# Altium project Benchtest_PIC32.PrjPcb
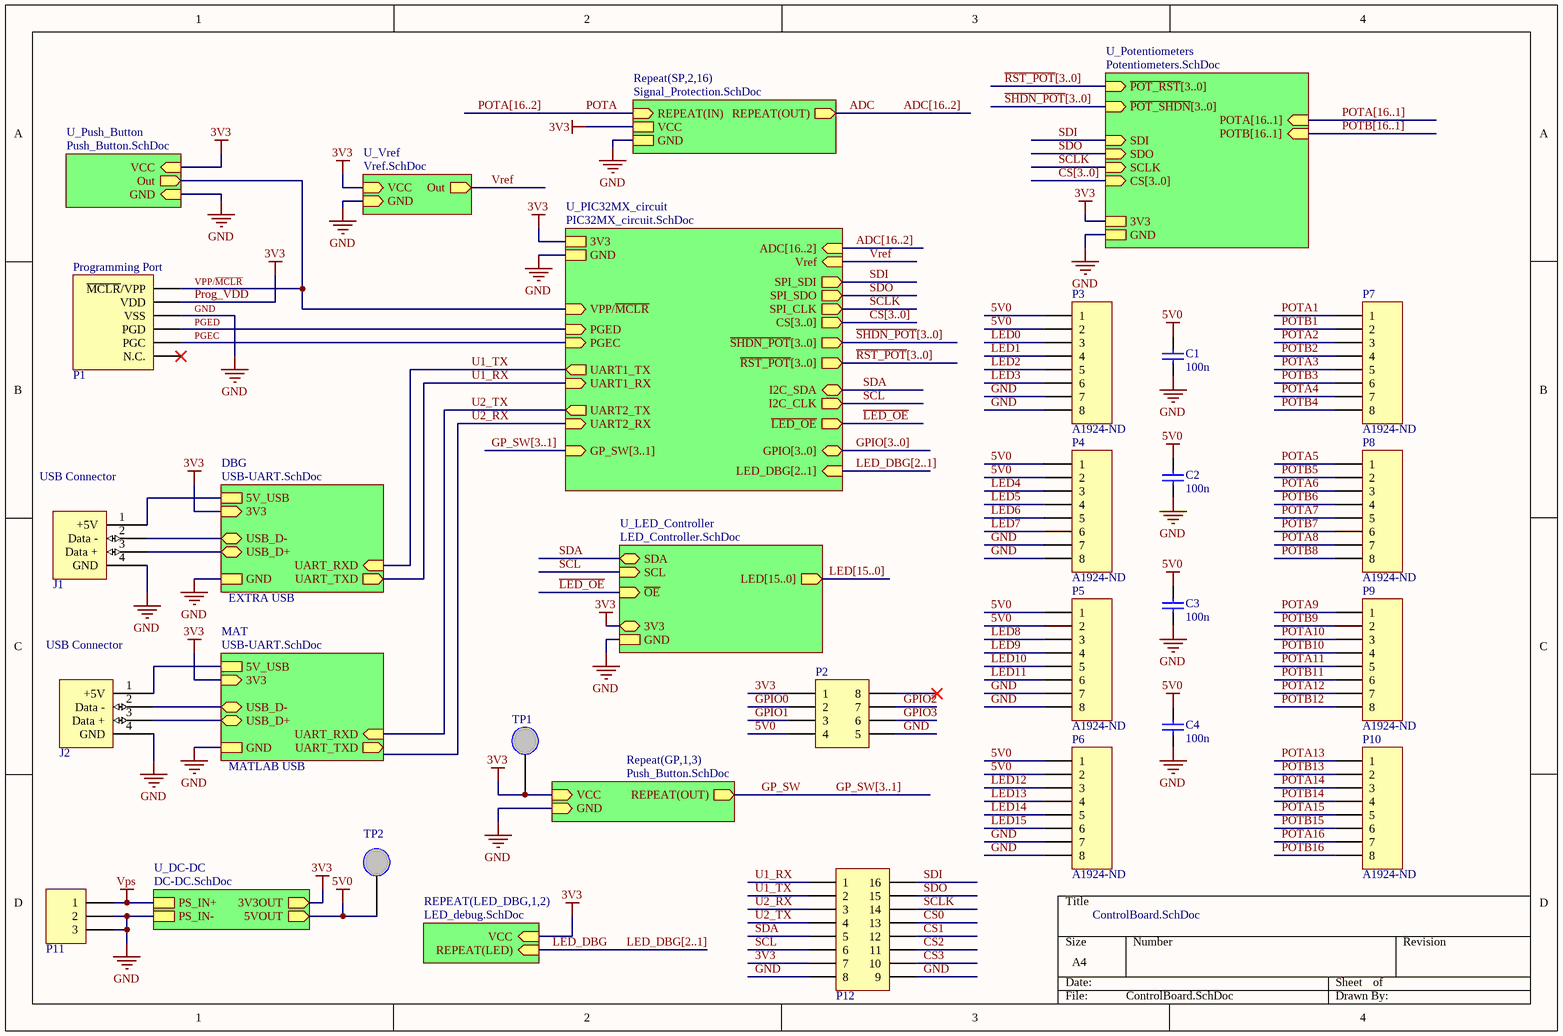
[diagram p0: ControlBoard.SchDoc]
6 sheets, 130 parts. Net scope: hierarchical (ports join the sheet entries above them; power ports are global).
Board file: Benchtest_PCB.PcbDoc
Sheets:
  ControlBoard.SchDoc
    U_Potentiometers = Potentiometers.SchDoc
    U_DC-DC = DC-DC.SchDoc
    GP1 = Push_Button.SchDoc
    GP2 = Push_Button.SchDoc
    GP3 = Push_Button.SchDoc
    SP2 = Signal_Protection.SchDoc
    SP3 = Signal_Protection.SchDoc
    SP4 = Signal_Protection.SchDoc
    SP5 = Signal_Protection.SchDoc
    SP6 = Signal_Protection.SchDoc
    SP7 = Signal_Protection.SchDoc
    SP8 = Signal_Protection.SchDoc
    SP9 = Signal_Protection.SchDoc
    SP10 = Signal_Protection.SchDoc
    SP11 = Signal_Protection.SchDoc
    SP12 = Signal_Protection.SchDoc
    SP13 = Signal_Protection.SchDoc
    SP14 = Signal_Protection.SchDoc
    SP15 = Signal_Protection.SchDoc
    SP16 = Signal_Protection.SchDoc
    U_Push_Button = Push_Button.SchDoc
    LED_DBG1 = LED_debug.SchDoc
    LED_DBG2 = LED_debug.SchDoc

## Sheet ControlBoard.SchDoc
size A4

### Parts
C1  value 100n  [CS-0603]  (hidden comment: CS - CAPACITOR)
C2  value 100n  [CS-0603]  (hidden comment: CS - CAPACITOR)
C3  value 100n  [CS-0603]  (hidden comment: CS - CAPACITOR)
C4  value 100n  [CS-0603]  (hidden comment: CS - CAPACITOR)
J1  USB 4 pins  [CON-USB TYPE B]  (value not drawn)
J2  USB 4 pins  [CON-USB TYPE B]  (value not drawn)
P1  CON - HEADER PROG  [CON-HEADER-1X6-RA]  (value not drawn)
P2  CON - HEADER 2X4  [CON-HEADER-2X4]  (value not drawn)
P3  Supplier Part Number 1: A1924-ND  [CON-HEADER-1X8]  (hidden comment: CON - HEADER 1X8)
P4  Supplier Part Number 1: A1924-ND  [CON-HEADER-1X8]  (hidden comment: CON - HEADER 1X8)
P5  Supplier Part Number 1: A1924-ND  [CON-HEADER-1X8]  (hidden comment: CON - HEADER 1X8)
P6  Supplier Part Number 1: A1924-ND  [CON-HEADER-1X8]  (hidden comment: CON - HEADER 1X8)
P7  Supplier Part Number 1: A1924-ND  [CON-HEADER-1X8]  (hidden comment: CON - HEADER 1X8)
P8  Supplier Part Number 1: A1924-ND  [CON-HEADER-1X8]  (hidden comment: CON - HEADER 1X8)
P9  Supplier Part Number 1: A1924-ND  [CON-HEADER-1X8]  (hidden comment: CON - HEADER 1X8)
P10  Supplier Part Number 1: A1924-ND  [CON-HEADER-1X8]  (hidden comment: CON - HEADER 1X8)
P11  CON - POWER CONNECTOR  [CON-POWER CONNECTOR]  (value not drawn)
P12  CON - HEADER 2X8  [CON-HEADER-2X8]  (value not drawn)
TP1  5003K  [TP - VERTICAL]  (value not drawn)
TP2  5003K  [TP - VERTICAL]  (value not drawn)

### Sub-sheets
DBG = USB-UART.SchDoc (file not in this document): 3V3 (in), GND, UART_RXD (in), UART_TXD (out), 5V_USB, USB_D- (bidir), USB_D+ (bidir)
MAT = USB-UART.SchDoc (file not in this document): 3V3 (in), GND, UART_RXD (in), UART_TXD (out), 5V_USB, USB_D- (bidir), USB_D+ (bidir)
Repeat(GP,1,3) = Push_Button.SchDoc: REPEAT(OUT) (out), GND (in), VCC (in)
REPEAT(LED_DBG,1,2) = LED_debug.SchDoc: VCC (in), REPEAT(LED) (in)
Repeat(SP,2,16) = Signal_Protection.SchDoc: REPEAT(IN) (in), REPEAT(OUT) (out), VCC, GND
U_DC-DC = DC-DC.SchDoc: 3V3OUT (out), 5VOUT (out), PS_IN+, PS_IN-
U_LED_Controller = LED_Controller.SchDoc (file not in this document): SDA (bidir), SCL (in), ~{OE} (in), LED[15..0] (out), GND, 3V3
U_PIC32MX_circuit = PIC32MX_circuit.SchDoc (file not in this document): 3V3, GND, UART2_TX (out), UART2_RX (in), GP_SW[3..1] (in), PGED (in), PGEC (in), VPP/~{MCLR} (in), ADC[16..2] (in), UART1_TX (out), UART1_RX (in), SPI_CLK (out), SPI_SDI (out), SPI_SDO (out), I2C_SDA (bidir), I2C_CLK (out), CS[3..0] (out), ~{LED_OE} (out), ~{RST_POT}[3..0] (out), ~{SHDN_POT}[3..0] (out), GPIO[3..0] (bidir), LED_DBG[2..1] (in), Vref (in)
U_Potentiometers = Potentiometers.SchDoc: SDI (in), SCLK (in), 3V3, GND, POTB[16..1] (in), CS[3..0] (in), ~{POT_RST}[3..0] (in), ~{POT_SHDN}[3..0] (in), SDO (in), POTA[16..1] (in)
U_Push_Button = Push_Button.SchDoc: Out (out), VCC (in), GND (in)
U_Vref = Vref.SchDoc (file not in this document): Out (out), VCC (in), GND (in)

### Nets
3V3: P1.2(VDD) P2.1 P12.7 TP1.1 ; sheet U_LED_Controller/3V3, sheet U_Potentiometers/3V3, sheet U_PIC32MX_circuit/3V3, sheet U_DC-DC/3V3OUT, sheet Repeat(GP,1,3)/VCC, sheet MAT/3V3, sheet DBG/3V3, sheet Repeat(SP,2,16)/VCC, sheet U_Push_Button/VCC, sheet REPEAT(LED_DBG,1,2)/VCC, sheet U_Vref/VCC  [also labelled Prog_VDD]
5V0: C1.1 C2.1 C3.1 C4.1 P2.4 P3.1 P3.2 P4.1 P4.2 P5.1 P5.2 P6.1 P6.2 TP2.1 ; sheet U_DC-DC/5VOUT
GND: C1.2 C2.2 C3.2 C4.2 J1.4(GND) J1.5(Shield) J1.6(Shield) J2.4(GND) J2.5(Shield) J2.6(Shield) P1.3(VSS) P2.5 P3.7 P3.8 P4.7 P4.8 P5.7 P5.8 P6.7 P6.8 P11.2 P11.3 P12.8 P12.9 ; sheet U_LED_Controller/GND, sheet U_Potentiometers/GND, sheet U_PIC32MX_circuit/GND, sheet U_DC-DC/PS_IN-, sheet Repeat(GP,1,3)/GND, sheet MAT/GND, sheet DBG/GND, sheet Repeat(SP,2,16)/GND, sheet U_Push_Button/GND, sheet U_Vref/GND
Vps: P11.1 ; sheet U_DC-DC/PS_IN+
ADC: sheet Repeat(SP,2,16)/REPEAT(OUT)
CS0: P12.13
CS1: P12.12
CS2: P12.11
CS3: P12.10
GP_SW: sheet Repeat(GP,1,3)/REPEAT(OUT)
GPIO0: P2.2
GPIO1: P2.3
GPIO2: P2.7
GPIO3: P2.6
~{LED_OE}: sheet U_LED_Controller/~{OE}, sheet U_PIC32MX_circuit/~{LED_OE}
LED0: P3.3
LED1: P3.4
LED2: P3.5
LED3: P3.6
LED4: P4.3
LED5: P4.4
LED6: P4.5
LED7: P4.6
LED8: P5.3
LED9: P5.4
LED10: P5.5
LED11: P5.6
LED12: P6.3
LED13: P6.4
LED14: P6.5
LED15: P6.6
LED_DBG: sheet REPEAT(LED_DBG,1,2)/REPEAT(LED)
PGEC: P1.5(PGC) ; sheet U_PIC32MX_circuit/PGEC
PGED: P1.4(PGD) ; sheet U_PIC32MX_circuit/PGED
POTA: sheet Repeat(SP,2,16)/REPEAT(IN)
POTA1: P7.1
POTA2: P7.3
POTA3: P7.5
POTA4: P7.7
POTA5: P8.1
POTA6: P8.3
POTA7: P8.5
POTA8: P8.7
POTA9: P9.1
POTA10: P9.3
POTA11: P9.5
POTA12: P9.7
POTA13: P10.1
POTA14: P10.3
POTA15: P10.5
POTA16: P10.7
POTB1: P7.2
POTB2: P7.4
POTB3: P7.6
POTB4: P7.8
POTB5: P8.2
POTB6: P8.4
POTB7: P8.6
POTB8: P8.8
POTB9: P9.2
POTB10: P9.4
POTB11: P9.6
POTB12: P9.8
POTB13: P10.2
POTB14: P10.4
POTB15: P10.6
POTB16: P10.8
SCL: P12.6 ; sheet U_LED_Controller/SCL, sheet U_PIC32MX_circuit/I2C_CLK
SCLK: P12.14 ; sheet U_Potentiometers/SCLK, sheet U_PIC32MX_circuit/SPI_CLK
SDA: P12.5 ; sheet U_LED_Controller/SDA, sheet U_PIC32MX_circuit/I2C_SDA
SDI: P12.16 ; sheet U_Potentiometers/SDI, sheet U_PIC32MX_circuit/SPI_SDI
SDO: P12.15 ; sheet U_Potentiometers/SDO, sheet U_PIC32MX_circuit/SPI_SDO
U1_RX: P12.1 ; sheet U_PIC32MX_circuit/UART1_RX, sheet DBG/UART_TXD
U1_TX: P12.2 ; sheet U_PIC32MX_circuit/UART1_TX, sheet DBG/UART_RXD
U2_RX: P12.3 ; sheet U_PIC32MX_circuit/UART2_RX
U2_TX: P12.4 ; sheet U_PIC32MX_circuit/UART2_TX, sheet MAT/UART_RXD
VPP/~{MCLR}: P1.1(~{MCLR}/VPP) ; sheet U_PIC32MX_circuit/VPP/~{MCLR}, sheet U_Push_Button/Out
Vref: sheet U_PIC32MX_circuit/Vref, sheet U_Vref/Out
NetJ1_1: J1.1(+5V) ; sheet DBG/5V_USB
NetJ1_2: J1.2(Data_-) ; sheet DBG/USB_D-
NetJ1_3: J1.3(Data_+) ; sheet DBG/USB_D+
NetJ2_1: J2.1(+5V) ; sheet MAT/5V_USB
NetJ2_2: J2.2(Data_-) ; sheet MAT/USB_D-
NetJ2_3: J2.3(Data_+) ; sheet MAT/USB_D+

Not connected (* = marked no-connect by the designer): P1 6(N.C.)*; P2 8*

### Buses and harness runs
bus ADC[16..2]
bus ADC[16..2] = sheet U_PIC32MX_circuit/ADC[16..2]
bus CS[3..0] = sheet U_PIC32MX_circuit/CS[3..0]
bus CS[3..0] = sheet U_Potentiometers/CS[3..0]
bus GP_SW[3..1]
bus GP_SW[3..1] = sheet U_PIC32MX_circuit/GP_SW[3..1]
bus GPIO[3..0] = sheet U_PIC32MX_circuit/GPIO[3..0]
bus LED[15..0] = sheet U_LED_Controller/LED[15..0]
bus LED_DBG[2..1]
bus LED_DBG[2..1] = sheet U_PIC32MX_circuit/LED_DBG[2..1]
bus POTA[16..1] = sheet U_Potentiometers/POTA[16..1]
bus POTA[16..2]
bus POTB[16..1] = sheet U_Potentiometers/POTB[16..1]
bus ~{RST_POT}[3..0] = sheet U_PIC32MX_circuit/~{RST_POT}[3..0]
bus ~{RST_POT}[3..0] = sheet U_Potentiometers/~{POT_RST}[3..0]
bus ~{SHDN_POT}[3..0] = sheet U_PIC32MX_circuit/~{SHDN_POT}[3..0]
bus ~{SHDN_POT}[3..0] = sheet U_Potentiometers/~{POT_SHDN}[3..0]

### Notes on the sheet
- (near P1) Programming Port
- (near J1) USB Connector
- (near J2) USB Connector
- EXTRA USB
- MATLAB USB

### Library data of the parts
C1-C4 = CS - CAPACITOR: TOLERANCE: 10%; VOLTAGE: 16V; Supplier 1: *; Supplier Part Number 1: *; (FIELD A): *; (FLIED C): *; (FIELD B): *; Manufacturer: *
J1 J2 = CON - USB TYPE B 4 pins: 4 pin USB connector with 2 shield pins; Manufacturer: FCI; Supplier 1: Digi-Key; Supplier Part Number 1: 609-3656-ND; (FLIED A): *; (FLIED B): *; (FLIED C): *
P1 = CON - PROG HEADER 6: MICROCHIP CONNECTOR; (FLIED A): *; (FLIED B): *; (FLIED C): *; Manufacturer: *; Supplier 1: Digi-Key; Supplier Part Number 1: 609-3263-ND
P2 = CON - HEADER 2X4: 100mil header 2 row 8pins; Manufacturer: *; (FIELD A): *; (FIELD B): *; (FIELD C): *; Supplier 1: Digi-Key; Supplier Part Number 1: 952-2122-ND
P3-P10 = CON - HEADER 1X8: 100mil header 1 row 6 pins; Manufacturer: *; (FIELD A): *; (FIELD B): *; (FIELD C): *; Supplier 1: Digi-Key
P11 = CON - POWER CONNECTOR: CONN PWR JACK 2.1X5.5MM HIGH CUR; Manufacturer: *; (FIELD A): *; (FIELD B): *; (FIELD C): *; Supplier 1: Digi-Key; Supplier Part Number 1: CP-002AH-ND
P12 = CON - HEADER 2X8: 100mil header 2 row 16pins; Manufacturer: *; (FIELD A): *; (FIELD B): *; (FIELD C): *; Supplier 1: Digi-Key; Supplier Part Number 1: 952-2128-ND
TP1 TP2 = TP - Test point vertical: (FIELD A): *; (FIELD B): *; (FIELD C): *; Manufacturer: *; Supplier 1: Newark; Supplier Part Number 1: 62W5140

## Sheet Potentiometers.SchDoc
size A4
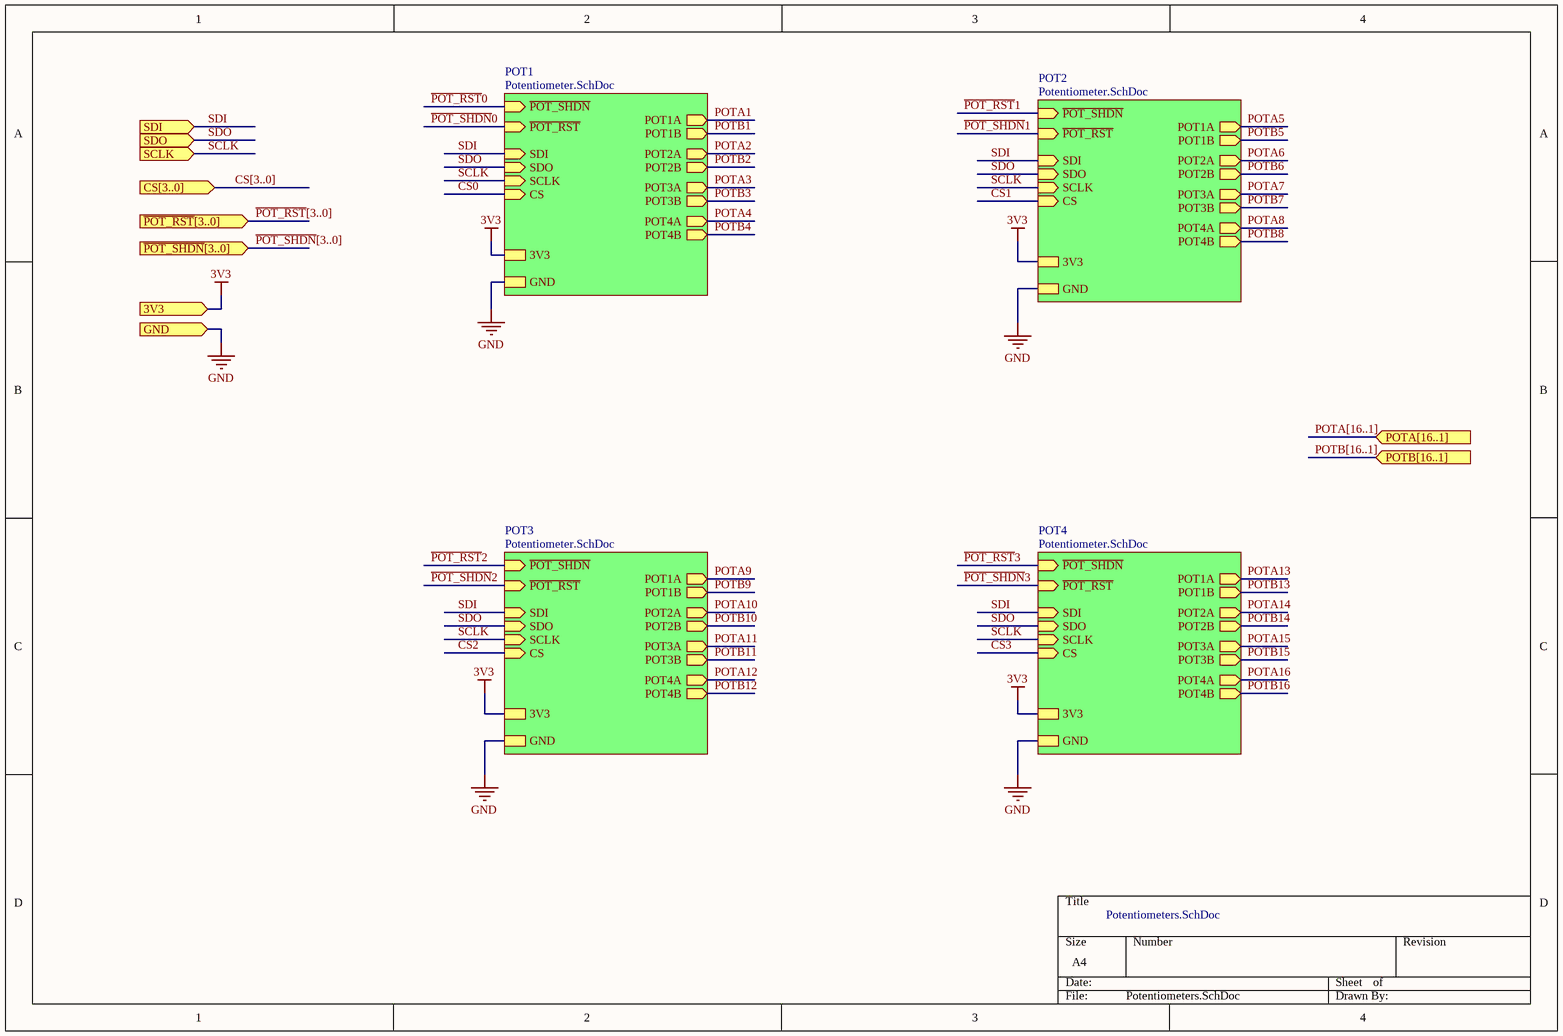
[diagram p1: Potentiometers.SchDoc]

### Sub-sheets
POT1 = Potentiometer.SchDoc (file not in this document): SDI (in), SCLK (in), CS (in), POT1A (out), POT1B (out), POT2A (out), POT2B (out), POT3A (out), POT3B (out), POT4A (out), POT4B (out), 3V3, GND, ~{POT_RST} (in), SDO (in), ~{POT_SHDN} (in)
POT2 = Potentiometer.SchDoc (file not in this document): SDI (in), SCLK (in), CS (in), POT1A (out), POT1B (out), POT2A (out), POT2B (out), POT3A (out), POT3B (out), POT4A (out), POT4B (out), 3V3, GND, ~{POT_RST} (in), SDO (in), ~{POT_SHDN} (in)
POT3 = Potentiometer.SchDoc (file not in this document): SDI (in), SCLK (in), CS (in), POT1A (out), POT1B (out), POT2A (out), POT2B (out), POT3A (out), POT3B (out), POT4A (out), POT4B (out), 3V3, GND, ~{POT_RST} (in), SDO (in), ~{POT_SHDN} (in)
POT4 = Potentiometer.SchDoc (file not in this document): SDI (in), SCLK (in), CS (in), POT1A (out), POT1B (out), POT2A (out), POT2B (out), POT3A (out), POT3B (out), POT4A (out), POT4B (out), 3V3, GND, ~{POT_RST} (in), SDO (in), ~{POT_SHDN} (in)

### Ports
3V3, CS[3..0] (in), GND, POTA[16..1] (in), POTB[16..1] (in), SCLK (in), SDI (in), SDO (in), ~{POT_RST}[3..0] (in), ~{POT_SHDN}[3..0] (in)

### Nets
3V3: port 3V3, sheet POT1/3V3, sheet POT2/3V3, sheet POT3/3V3, sheet POT4/3V3
GND: port GND, sheet POT1/GND, sheet POT2/GND, sheet POT3/GND, sheet POT4/GND
~{POT_RST}0: sheet POT1/~{POT_SHDN}
~{POT_RST}1: sheet POT2/~{POT_SHDN}
~{POT_RST}2: sheet POT3/~{POT_SHDN}
~{POT_RST}3: sheet POT4/~{POT_SHDN}
~{POT_SHDN}0: sheet POT1/~{POT_RST}
~{POT_SHDN}1: sheet POT2/~{POT_RST}
~{POT_SHDN}2: sheet POT3/~{POT_RST}
~{POT_SHDN}3: sheet POT4/~{POT_RST}
SCLK: port SCLK, sheet POT1/SCLK, sheet POT2/SCLK, sheet POT3/SCLK, sheet POT4/SCLK
SDI: port SDI, sheet POT1/SDI, sheet POT2/SDI, sheet POT3/SDI, sheet POT4/SDI
SDO: port SDO, sheet POT1/SDO, sheet POT2/SDO, sheet POT3/SDO, sheet POT4/SDO

### Buses and harness runs
bus CS[3..0] = port CS[3..0]
bus POTA[16..1] = port POTA[16..1]
bus POTB[16..1] = port POTB[16..1]
bus ~{POT_RST}[3..0] = port ~{POT_RST}[3..0]
bus ~{POT_SHDN}[3..0] = port ~{POT_SHDN}[3..0]

## Sheet DC-DC.SchDoc
size A4
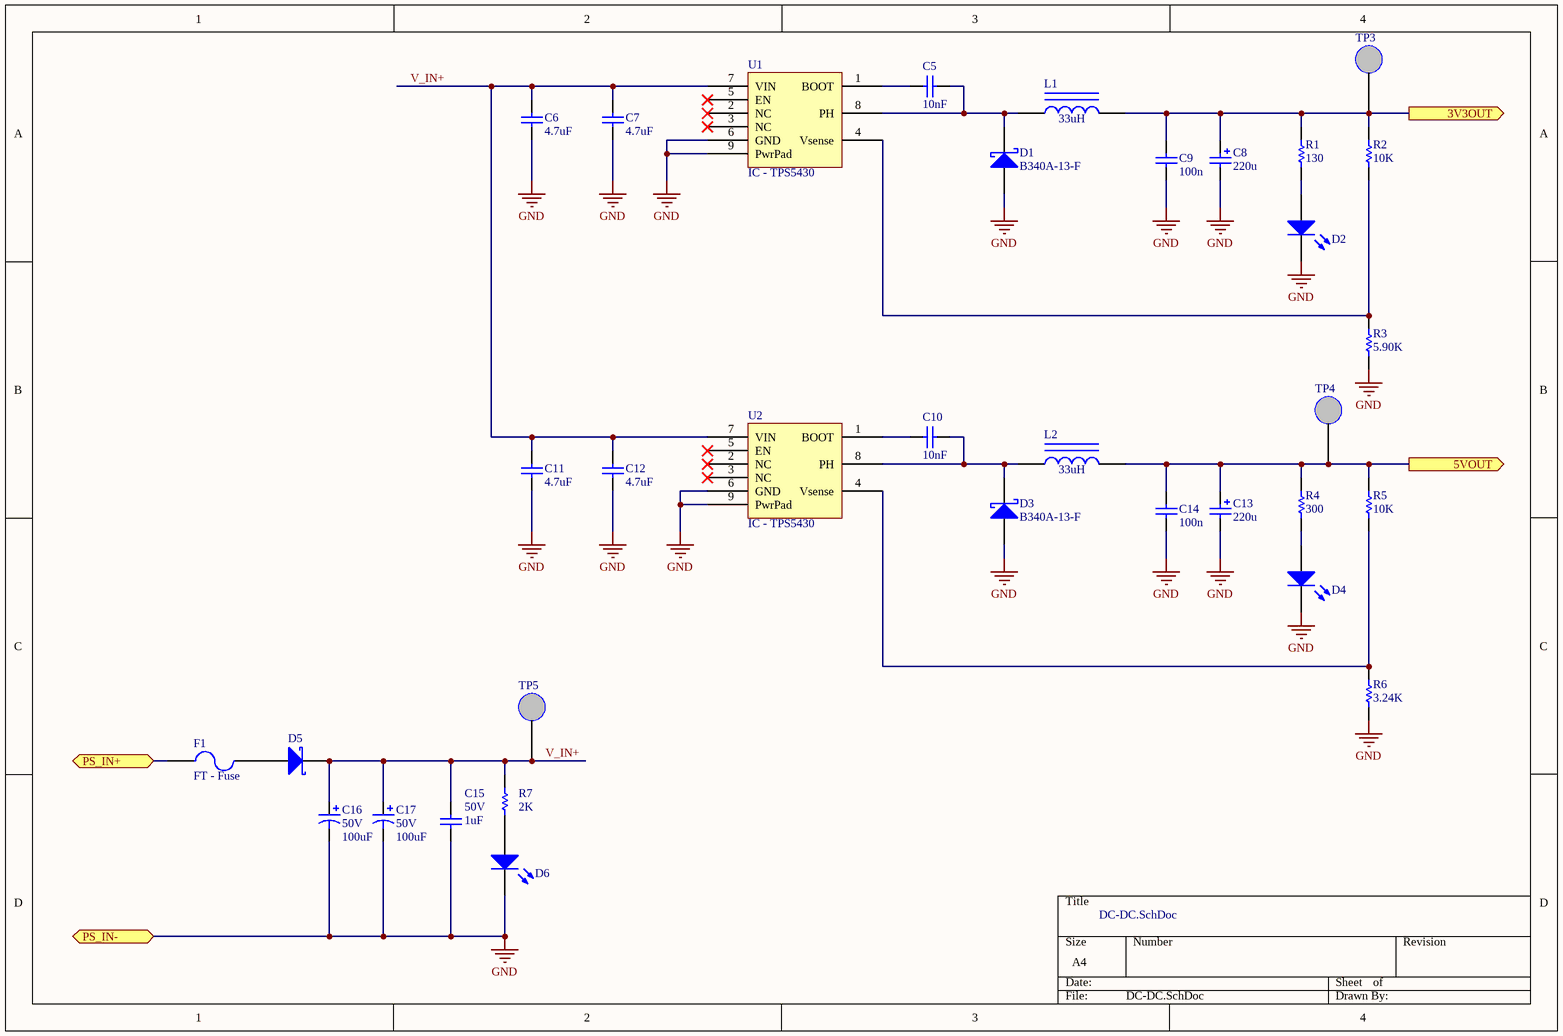
[diagram p2: DC-DC.SchDoc]

### Parts
C5  value 10nF  [CS-0603]  (hidden comment: CS - CAPACITOR)
C6  value 4.7uF  [CS-1206]  (hidden comment: CS - CAPACITOR)
C7  value 4.7uF  [CS-1206]  (hidden comment: CS - CAPACITOR)
C8  value 220u  [CS-2312]  (hidden comment: CS - CAPACITOR POL)
C9  value 100n  [CS-0603]  (hidden comment: CS - CAPACITOR)
C10  value 10nF  [CS-0603]  (hidden comment: CS - CAPACITOR)
C11  value 4.7uF  [CS-1206]  (hidden comment: CS - CAPACITOR)
C12  value 4.7uF  [CS-1206]  (hidden comment: CS - CAPACITOR)
C13  value 220u  [CS-2312]  (hidden comment: CS - CAPACITOR POL)
C14  value 100n  [CS-0603]  (hidden comment: CS - CAPACITOR)
C15  value 1uF  VOLTAGE: 50V  [CS-0603]  (hidden comment: CS - CAPACITOR)
C16  value 100uF  VOLTAGE: 50V  [CT-CAP-ALUM-8X14]  (hidden comment: CT - CAPACITOR ELECTROLYTIC)
C17  value 100uF  VOLTAGE: 50V  [CT-CAP-ALUM-8X14]  (hidden comment: CT - CAPACITOR ELECTROLYTIC)
D1  B340A-13-F  [DS-DO-214AC-SMA]
D2  LED - NORMAL LED  [LED-0603 YELLOW]  (value not drawn)
D3  B340A-13-F  [DS-DO-214AC-SMA]
D4  LED - NORMAL LED  [LED-0603 YELLOW]  (value not drawn)
D5  DT - Diode  [TO-220AC]  (value not drawn)
D6  LED - NORMAL LED  [LED-0603 YELLOW]  (value not drawn)
F1  FT - Fuse  [FT - 5mm x 20mm]
L1  value 33uH  [LS-Inductor SMD]  (hidden comment: LS - INDUCTOR)
L2  value 33uH  [LS-Inductor SMD]  (hidden comment: LS - INDUCTOR)
R1  value 130  [RS-0603]  (hidden comment: RS - RESISTOR)
R2  value 10K  [RS-0603]  (hidden comment: RS - RESISTOR)
R3  value 5.90K  [RS-0603]  (hidden comment: RS - RESISTOR)
R4  value 300  [RS-0603]  (hidden comment: RS - RESISTOR)
R5  value 10K  [RS-0603]  (hidden comment: RS - RESISTOR)
R6  value 3.24K  [RS-0603]  (hidden comment: RS - RESISTOR)
R7  value 2K  [RS-0603]  (hidden comment: RS - RESISTOR)
TP3  5003K  [TP - VERTICAL]  (value not drawn)
TP4  5003K  [TP - VERTICAL]  (value not drawn)
TP5  5003K  [TP - VERTICAL]  (value not drawn)
U1  IC - TPS5430  [IC-SOIC8-POWERPAD]
U2  IC - TPS5430  [IC-SOIC8-POWERPAD]

### Ports
3V3OUT (out), 5VOUT (out), PS_IN+, PS_IN-

### Nets
3V3: C8.1 C9.2 L1.2 R1.1 R2.1 TP3.1 ; port 3V3OUT
5V0: C13.1 C14.2 L2.2 R4.1 R5.1 TP4.1 ; port 5VOUT
GND: C6.1 C7.1 C8.2 C9.1 C11.1 C12.1 C13.2 C14.1 C15.1 C16.2 C17.2 D1.A D2.K D3.A D4.K D6.K R3.2 R6.2 U1.6(GND) U1.9(PwrPad) U2.6(GND) U2.9(PwrPad) ; port PS_IN-
Vps: F1.1 ; port PS_IN+
V_IN+: C6.2 C7.2 C11.2 C12.2 C15.2 C16.1 C17.1 D5.1(K) R7.2 TP5.1 U1.7(VIN) U2.7(VIN)
NetC5_1: C5.1 D1.K L1.1 U1.8(PH)
NetC5_2: C5.2 U1.1(BOOT)
NetC10_1: C10.1 D3.K L2.1 U2.8(PH)
NetC10_2: C10.2 U2.1(BOOT)
NetD2_A: D2.A R1.2
NetD4_A: D4.A R4.2
NetD5_3: D5.3(A) F1.2
NetD6_A: D6.A R7.1
NetR2_2: R2.2 R3.1 U1.4(Vsense)
NetR5_2: R5.2 R6.1 U2.4(Vsense)

Not connected (* = marked no-connect by the designer): U1 2(NC)* 3(NC)* 5(EN)*; U2 2(NC)* 3(NC)* 5(EN)*

### Library data of the parts
C5 = CS - CAPACITOR: CAP CER 10000PF 50V 10% X7R 0603; Manufacturer: TDK; (FIELD A): tantalum; VOLTAGE: 16V; Supplier 1: Digikey; Supplier Part Number 1: 445-1311-1-ND; (FLIED C): *; (FIELD B): *; TOLERANCE: 10%
C6 C7 C11 C12 = CS - CAPACITOR: Manufacturer: Samsung; TOLERANCE: 10%; VOLTAGE: 16V; Supplier 1: Digikey; Supplier Part Number 1: 1276-1292-1-ND; (FIELD A): *; (FLIED C): *; (FIELD B): *
C8 C13 = CS - CAPACITOR POL: TOLERANCE: 10%; Supplier 1: *; Supplier Part Number 1: *; (FIELD A): *; (FLIED C): *; (FIELD B): *; Manufacturer: *; VOLTAGE: VOLTAGE; Supplier 2: Digi-Key; Supplier Part Number 2: 478-5236-1-ND
C9 C14 = CS - CAPACITOR: TOLERANCE: 10%; VOLTAGE: 16V; Supplier 1: *; Supplier Part Number 1: 490-1532-1-ND; (FIELD A): *; (FLIED C): *; (FIELD B): *; Manufacturer: *
C10 = CS - CAPACITOR: CAP CER 10000PF 50V 10% X7R 0603; Manufacturer: TDK; (FIELD A): Tantalum; VOLTAGE: 16V; Supplier 1: Digikey; Supplier Part Number 1: 445-1311-1-ND; (FLIED C): *; (FIELD B): *; TOLERANCE: 10%
C15 = CS - CAPACITOR: TOLERANCE: 10%; Supplier 1: *; Supplier Part Number 1: *; (FIELD A): *; (FLIED C): *; (FIELD B): *; Manufacturer: *
C16 C17 = CT - CAPACITOR ELECTROLYTIC: TOLERANCE: 10%; Supplier 1: *; Supplier Part Number 1: *; (FIELD A): *; (FLIED C): *; (FIELD B): *; Manufacturer: *
D1 D3 = DS - Schottky: DIODE SCHOTTKY 40V 3A SMA; Manufacturer: Diodes Incorporated; Supplier Part Number 1: B340A-FDICT-ND; Supplier 1: Digikey; FORWARS VOLTAGE: *; (FIELD A): *; (FIELD B): *; (FIELD C): *; Supplier 2: Digi-Key; Supplier Part Number 2: B340A-FDICT-ND
D5 = Diode 18TQ045: Zener Schottky; Supplier 1: *; Supplier 2: Digi-Key; FORWARD VOLTAGE: *; Supplier Part Number 2: MBR1645-E3/45GI-ND; Supplier Part Number 1: *; (FIELD A): *; (FIELD B): *; (FIELD C): *; CURRENT MAX: *
F1 = FT - Fuse: Manufacturer: Schurter Inc; Supplier 1: Digikey; Supplier Part Number 1: 486-1259-ND
L1 L2 = LS - INDUCTOR: INDUCTOR SHIELD PWR; Manufacturer: Bourns Inc; CURRENT: 2.8A; IMAX: 3A; (FIELD A): *; (FIELD B): *; (FIELD C): *; RESISTOR: *; Supplier 1: Digikey; Supplier Part Number 1: SRR1260-330M
R1-R6 = RS - RESISTOR: TOLERANCE: RES TOL; POWER: RES POWER; Supplier Part Number 1: *; Supplier 1: *; (FIELD A): *; (FLIED C): *; (FIELD B): *; Manufacturer: *
R7 = RS - RESISTOR: TOLERANCE: RES TOL; POWER: 1/10W; Supplier Part Number 1: *; Supplier 1: *; (FIELD A): *; (FLIED C): *; (FIELD B): *; Manufacturer: *
TP3-TP5 = TP - Test point vertical: (FIELD A): *; (FIELD B): *; (FIELD C): *; Manufacturer: *; Supplier 1: Newark; Supplier Part Number 1: 62W5140
U1 U2 = IC - TPS5430: IC REG BUCK ADJ 3A 8SOPWRPAD; Manufacturer: Texas Instruments; Part Number: TPS5430; Supplier 1: Digi-Key; Supplier Part Number 1: 296-26988-1-ND
D2 D4 D6 = LED - NORMAL LED: FORWARS VOLTAGE: *; CURRENT: *; COLOR: *; Supplier Part Number 1: *; Supplier 1: *; (FIELD B): *; (FIELD A): *; (FIELD C): *; Manufacturer: *

## Sheet Push_Button.SchDoc
size A4
Used 4 times, as channels GP1, GP2, GP3, U_Push_Button. Parts and nets are listed once, with the designators drawn on the sheet.
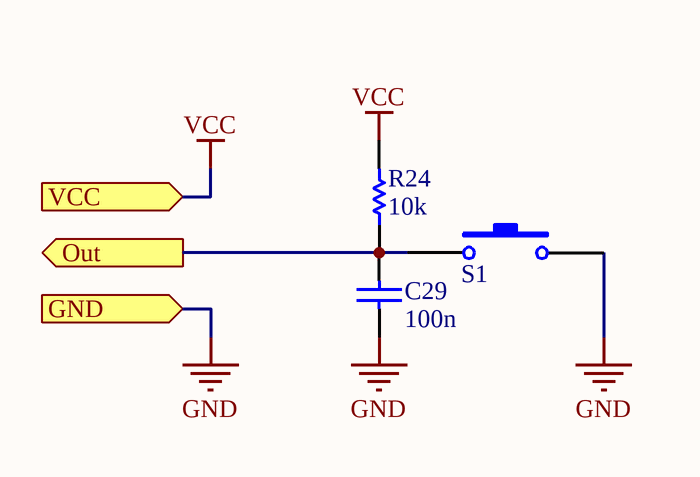
[diagram p3: Push_Button.SchDoc]

### Parts
C29  value 100n  [CS-0603]  (hidden comment: CS - CAPACITOR)
R24  value 10k  [RS-0603]  (hidden comment: RS - RESISTOR)
S1  SW - Tactile Switch  [SW-FSMRA]  (value not drawn)

### Ports
GND (in), Out (out), VCC (in)

### Nets
GND: C29.1 S1.2 ; port GND
VCC: R24.2 ; port VCC
Out: C29.2 R24.1 S1.1 ; port Out

### Channels
GP1: designators end in .1; ports GND=GND Out=GP_SW1 VCC=3V3
GP2: designators end in .2; ports GND=GND Out=GP_SW2 VCC=3V3
GP3: designators end in .3; ports GND=GND Out=GP_SW3 VCC=3V3
U_Push_Button: designators end in .4; ports GND=GND Out=VPP/~{MCLR} VCC=3V3

### Library data of the parts
C29 = CS - CAPACITOR: TOLERANCE: 10%; VOLTAGE: 16V; Supplier 1: *; Supplier Part Number 1: 490-1532-1-ND; (FIELD A): *; (FLIED C): *; (FIELD B): *; Manufacturer: *
R24 = RS - RESISTOR: TOLERANCE: RES TOL; POWER: RES POWER; Supplier Part Number 1: *; Supplier 1: *; (FIELD A): *; (FLIED C): *; (FIELD B): *; Manufacturer: *
S1 = SW - Tactile Switch: Supplier 1: Digi-Key; Supplier Part Number 1: 450-1658-ND; (FLIED A): *; (FLIED B): *; (FLIED C): *; Manufacturer: *; Supplier 2: Digi-Key; Supplier Part Number 2: 450-1758-2-ND

## Sheet Signal_Protection.SchDoc
size A4
Used 15 times, as channels SP2, SP3, SP4, SP5, SP6, SP7, SP8, SP9, SP10, SP11, SP12, SP13, SP14, SP15, SP16. Parts and nets are listed once, with the designators drawn on the sheet.
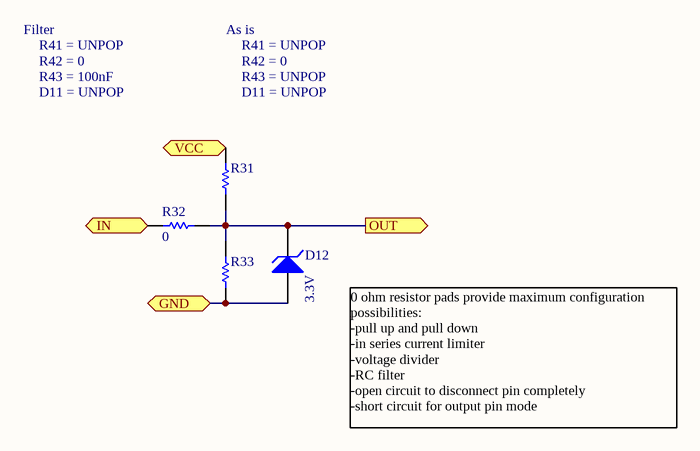
[diagram p4: Signal_Protection.SchDoc]

### Parts
D12  Voltage - Reverse Standoff (Typ): 3.3V  [DS-SOD523]  (hidden comment: DS - TVS ESD5Z3.3T1G)
R31  RS - RESISTOR  [RS-0603]  (value not drawn)
R32  value 0  [RS-0603]  (hidden comment: RS - RESISTOR)
R33  RS - RESISTOR  [RS-0603]  (value not drawn)

### Ports
GND, IN (in), OUT (out), VCC

### Nets
GND: D12.A R33.1 ; port GND
IN: R32.2 ; port IN
OUT: D12.K R31.2 R32.1 R33.2 ; port OUT
VCC: R31.1 ; port VCC

### Channels
SP2: designators end in .1; ports GND=GND IN=POTA2 OUT=ADC2 VCC=3V3
SP3: designators end in .2; ports GND=GND IN=POTA3 OUT=ADC3 VCC=3V3
SP4: designators end in .3; ports GND=GND IN=POTA4 OUT=ADC4 VCC=3V3
SP5: designators end in .4; ports GND=GND IN=POTA5 OUT=ADC5 VCC=3V3
SP6: designators end in .5; ports GND=GND IN=POTA6 OUT=ADC6 VCC=3V3
SP7: designators end in .6; ports GND=GND IN=POTA7 OUT=ADC7 VCC=3V3
SP8: designators end in .7; ports GND=GND IN=POTA8 OUT=ADC8 VCC=3V3
SP9: designators end in .8; ports GND=GND IN=POTA9 OUT=ADC9 VCC=3V3
SP10: designators end in .9; ports GND=GND IN=POTA10 OUT=ADC10 VCC=3V3
SP11: designators end in .10; ports GND=GND IN=POTA11 OUT=ADC11 VCC=3V3
SP12: designators end in .11; ports GND=GND IN=POTA12 OUT=ADC12 VCC=3V3
SP13: designators end in .12; ports GND=GND IN=POTA13 OUT=ADC13 VCC=3V3
SP14: designators end in .13; ports GND=GND IN=POTA14 OUT=ADC14 VCC=3V3
SP15: designators end in .14; ports GND=GND IN=POTA15 OUT=ADC15 VCC=3V3
SP16: designators end in .15; ports GND=GND IN=POTA16 OUT=ADC16 VCC=3V3

### Notes on the sheet
- Filter
- R41 = UNPOP
- R42 = 0
- R43 = 100nF
- As is
- R43 = UNPOP
- D11 = UNPOP
- 0 ohm resistor pads provide maximum configuration possibilities:
  -pull up and pull down
  -in series current limiter
  -voltage divider
  -RC filter
  -open circuit to disconnect pin completely
  -short circuit for output pin mode

### Library data of the parts
D12 = DS - TVS ESD5Z3.3T1G: TVS 3.3V; Manufacturer: ON Semiconductor; FORWARS VOLTAGE: *; (FIELD A): *; (FIELD B): *; Supplier 1: Digi-Key; Supplier Part Number 1: ESD5Z3.3T1GOSCT-ND
R31-R33 = RS - RESISTOR: TOLERANCE: RES TOL; POWER: RES POWER; Supplier Part Number 1: *; Supplier 1: *; (FIELD A): *; (FLIED C): *; (FIELD B): *; Manufacturer: *

## Sheet LED_debug.SchDoc
size A4
Used 2 times, as channels LED_DBG1, LED_DBG2. Parts and nets are listed once, with the designators drawn on the sheet.
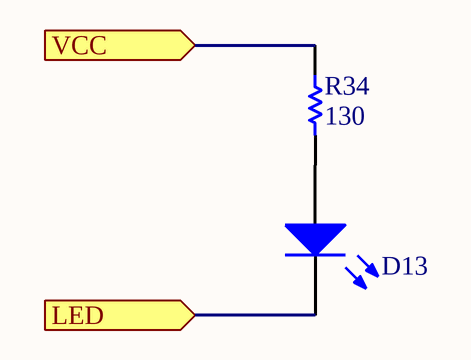
[diagram p5: LED_debug.SchDoc]

### Parts
D13  LED - NORMAL LED  [LED-0603 GREEN]  (value not drawn)
R34  value 130  [RS-0603]  (hidden comment: RS - RESISTOR)

### Ports
LED (in), VCC (in)

### Nets
LED: D13.K ; port LED
VCC: R34.1 ; port VCC
NetD13_A: D13.A R34.2

### Channels
LED_DBG1: designators end in .1; ports LED=LED_DBG1 VCC=3V3
LED_DBG2: designators end in .2; ports LED=LED_DBG2 VCC=3V3

### Library data of the parts
R34 = RS - RESISTOR: POWER: RES POWER; TOLERANCE: RES TOL; Supplier Part Number 1: *; Supplier 1: *; (FIELD A): *; (FLIED C): *; (FIELD B): *; Manufacturer: *
D13 = LED - NORMAL LED: CURRENT: *; COLOR: *; FORWARS VOLTAGE: *; Supplier Part Number 1: *; Supplier 1: *; (FIELD B): *; (FIELD A): *; (FIELD C): *; Manufacturer: *

## Nets that join several sheets
3V3: ControlBoard (P1.2 P2.1 P12.7 TP1.1), DC-DC (6 pins), GP1 (R24.1.2), GP2 (R24.2.2), GP3 (R24.3.2), SP2 (R31.1.1), SP3 (R31.2.1), SP4 (R31.3.1), SP5 (R31.4.1), SP6 (R31.5.1), SP7 (R31.6.1), SP8 (R31.7.1), SP9 (R31.8.1), SP10 (R31.9.1), SP11 (R31.10.1), SP12 (R31.11.1), SP13 (R31.12.1), SP14 (R31.13.1), SP15 (R31.14.1), SP16 (R31.15.1), U_Push_Button (R24.4.2), LED_DBG1 (R34.1.1), LED_DBG2 (R34.2.1)
5V0: ControlBoard (14 pins), DC-DC (6 pins)
GND: ControlBoard (24 pins), DC-DC (22 pins), GP1 (C29.1.1 S1.1.2), GP2 (C29.2.1 S1.2.2), GP3 (C29.3.1 S1.3.2), SP2 (D12.1.A R33.1.1), SP3 (D12.2.A R33.2.1), SP4 (D12.3.A R33.3.1), SP5 (D12.4.A R33.4.1), SP6 (D12.5.A R33.5.1), SP7 (D12.6.A R33.6.1), SP8 (D12.7.A R33.7.1), SP9 (D12.8.A R33.8.1), SP10 (D12.9.A R33.9.1), SP11 (D12.10.A R33.10.1), SP12 (D12.11.A R33.11.1), SP13 (D12.12.A R33.12.1), SP14 (D12.13.A R33.13.1), SP15 (D12.14.A R33.14.1), SP16 (D12.15.A R33.15.1), U_Push_Button (C29.4.1 S1.4.2)
Vps: ControlBoard (P11.1), DC-DC (F1.1)
POTA2: ControlBoard (P7.3), SP2 (R32.1.2)
POTA3: ControlBoard (P7.5), SP3 (R32.2.2)
POTA4: ControlBoard (P7.7), SP4 (R32.3.2)
POTA5: ControlBoard (P8.1), SP5 (R32.4.2)
POTA6: ControlBoard (P8.3), SP6 (R32.5.2)
POTA7: ControlBoard (P8.5), SP7 (R32.6.2)
POTA8: ControlBoard (P8.7), SP8 (R32.7.2)
POTA9: ControlBoard (P9.1), SP9 (R32.8.2)
POTA10: ControlBoard (P9.3), SP10 (R32.9.2)
POTA11: ControlBoard (P9.5), SP11 (R32.10.2)
POTA12: ControlBoard (P9.7), SP12 (R32.11.2)
POTA13: ControlBoard (P10.1), SP13 (R32.12.2)
POTA14: ControlBoard (P10.3), SP14 (R32.13.2)
POTA15: ControlBoard (P10.5), SP15 (R32.14.2)
POTA16: ControlBoard (P10.7), SP16 (R32.15.2)
VPP/~{MCLR}: ControlBoard (P1.1), U_Push_Button (C29.4.2 R24.4.1 S1.4.1)